# Altium schematic sheet Peripherals.SchDoc
size B; SheetNumber: 4; SheetTotal: 4
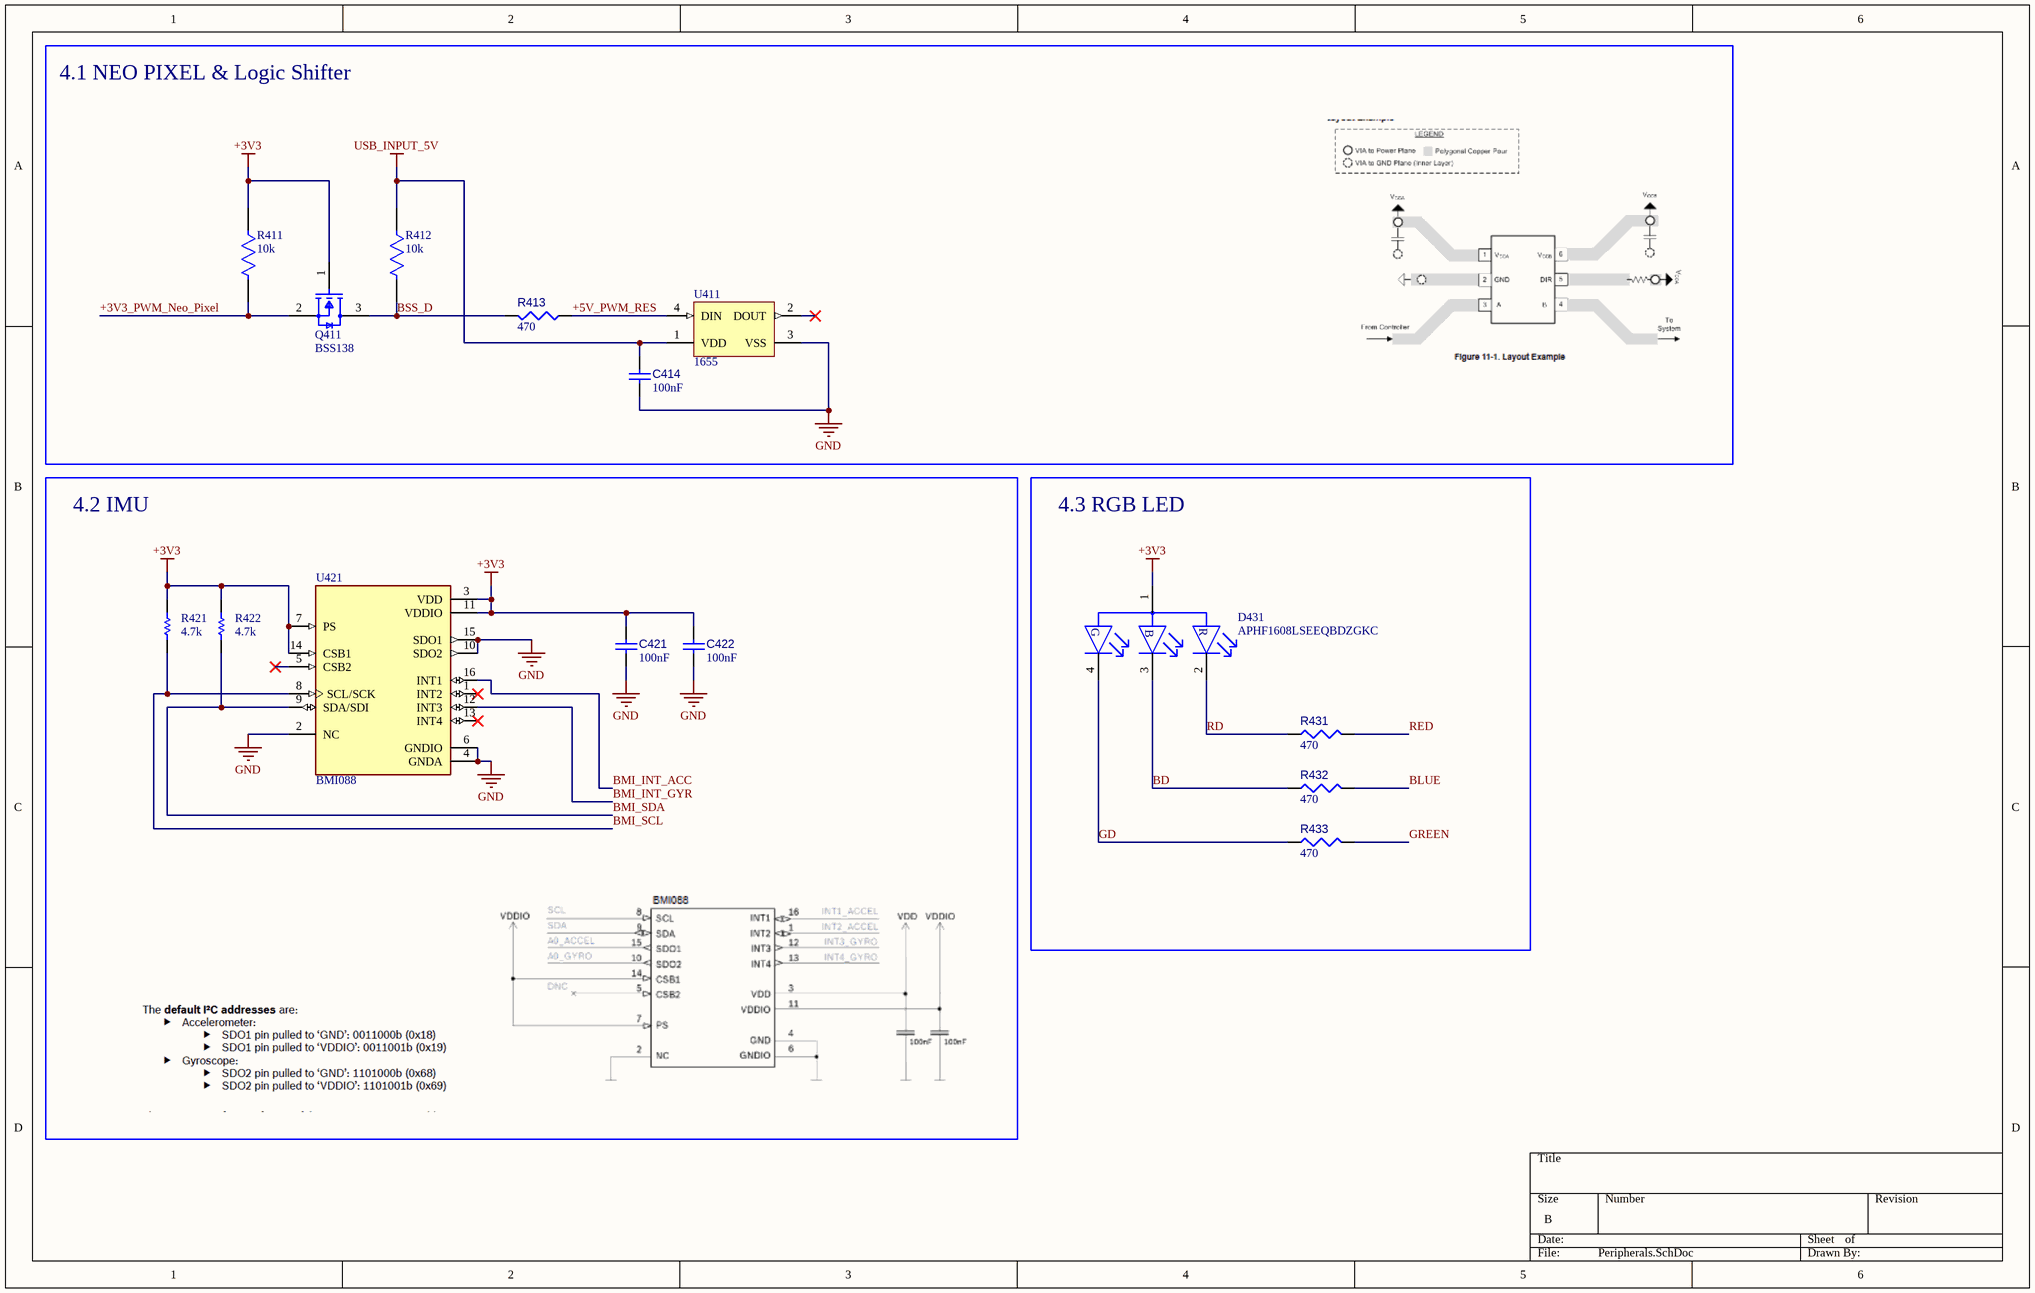
[diagram p0: Peripherals.SchDoc]

## Parts
C414  value 100nF  [CAPC0402(1005)60_L]  (hidden comment: Capacitor 100nF +/-20% 10V 0402)
C421  value 100nF  [CAPC0402(1005)60_L]  (hidden comment: Capacitor 100nF +/-20% 10V 0402)
C422  value 100nF  [CAPC0402(1005)60_L]  (hidden comment: Capacitor 100nF +/-20% 10V 0402)
D431  APHF1608LSEEQBDZGKC  [FP-APHF1608LSEEQBDZGKC-MFG]
Q411  BSS138  [FP-318-08-IPC_B]
R411  value 10k  [FP-RC0402-0_4-MFG]  (hidden comment: RC0402JR-0710KL)
R412  value 10k  [FP-RC0402-0_4-MFG]  (hidden comment: RC0402JR-0710KL)
R413  value 470  [RESC0805(2012)_L]  (hidden comment: Resistor 470R +/-5% 0805 125 mW)
R421  value 4.7k  [RESC1609X50X30NL10T20]  (hidden comment: CRCW06034K70FKTA)
R422  value 4.7k  [RESC1609X50X30NL10T20]  (hidden comment: CRCW06034K70FKTA)
R431  value 470  [RESC0805(2012)_L]  (hidden comment: Resistor 470R +/-5% 0805 125 mW)
R432  value 470  [RESC0805(2012)_L]  (hidden comment: Resistor 470R +/-5% 0805 125 mW)
R433  value 470  [RESC0805(2012)_L]  (hidden comment: Resistor 470R +/-5% 0805 125 mW)
U411  1655  [ADA-RGB-1655_V]
U421  BMI088  [PQFN50P450X300X100-16N]

## Blocks framed on the sheet
4.1 NEO PIXEL & Logic Shifter: C414 Q411 R411-R413 U411
4.2 IMU: C421 C422 R421 R422 U421
4.3 RGB LED: D431 R431-R433

## Nets
+3V3: C421.2 C422.2 D431.1(COMMON_ANODE) Q411.1(G) R411.1 R421.2 R422.2 U421.3(VDD) U421.7(PS) U421.11(VDDIO) U421.14(CSB1)
GND: C414.1 C421.1 C422.1 U411.3(VSS) U421.2(NC) U421.4(GNDA) U421.6(GNDIO) U421.10(SDO2) U421.15(SDO1)
USB_INPUT_5V: C414.2 R412.1 U411.1(VDD)
+3V3_PWM_Neo_Pixel: Q411.2(S) R411.2
+5V_PWM_RES: R413.1 U411.4(DIN)
BD: D431.3(Blue_C) R432.1
BLUE: R432.2
BMI_INT_ACC: U421.16(INT1)
BMI_INT_GYR: U421.12(INT3)
BMI_SCL: R421.1 U421.8(SCL/SCK)
BMI_SDA: R422.1 U421.9(SDA/SDI)
BSS_D: Q411.3(D) R412.2 R413.2
GD: D431.4(Green_C) R433.1
GREEN: R433.2
RD: D431.2(Red_C) R431.1
RED: R431.2

Not connected (* = marked no-connect by the designer): U411 2(DOUT)*; U421 1(INT2)* 5(CSB2)* 13(INT4)*

## Notes on the sheet
- (in symbol CMP-44529-000066-1) G; B; R

## Library data of the parts
C414 C421 C422 = CMP-001-00061-3: Chip Capacitor, 100nF +/-20%, 10V, 0402, Thickness 0.6 mm; Tolerance: 20%; Mounting Technology: SMT; Voltage Rating: 10V; Max Operating Temperature: 85°C; Pins: 2; Case/Package: 0402; Min Operating Temperature: -55°C
D431 = CMP-44529-000066-1: LED RGB CLEAR 4SMD; Test Current: 2mA; Lens Color: Colorless; Lens Size: 0.8mm; Viewing Angle: 140°; Element Configuration: Common Anode; Forward Voltage: 2.65V; Luminous Intensity: 10mcd; Color: Blue; Lens Style: Flat; Dominant Wavelength: 465nm; Packaging: Tape and Reel; Mount: Surface Mount; Length: 1.6mm; RoHS Compliant: Yes; Lens Transparency: Clear; Width: 0.8mm; Case/Package: SMD/SMT; Height: 0.6mm
Q411 = CMP-013-00036-1: Small Signal Field-Effect Transistor, 0.22A I(D), 50V, 1-Element, N-Channel, Silicon, Metal-oxide Semiconductor FET; RoHS Compliant: Yes
R411 R412 = CMP-009-00196-1: Fixed Resistor, Metal Glaze/thick Film, 0.0625W, 10000ohm, 50V, 5% +/-Tol, 100ppm/Cel, Surface Mount, 0402; Package Width: 0.5mm; Rated Temperature: 70°C; Power: 62.5mW; Package Height: 0.35mm; Temperature Coefficient: 100ppm/°C; Package Length: 1mm; Additional Feature: LASER TRIMMABLE; Reach SVHC Compliant: Yes; Terminal Finish: Nickel; Package Shape: Rectangular; Package Style: SMTMeter; JESD-609 Code: e3; Tolerance: 5%; Technology: METAL GLAZE/THICK FILM; Case/Package: 0402; Working Voltage: 50V; Termination: Wraparound; Min Operating Temperature: -55°C; Resistor Type: FIXED RESISTOR; Max Operating Temperature: 155°C; Construction: Chip; RoHS Compliant: Yes; Packaging: Tape and Reel; Mounting Technology: Surface Mount; Pins: 2
R413 R431-R433 = CMP-009-00122-3: Chip Resistor, 470 Ohms, +/-5%, 125 mW, -55 to 155 degC, 0805; Tolerance: 5%; Power: 125mW; Max Operating Temperature: 155°C; Case/Package: 0805; Pins: 2; Min Operating Temperature: -55°C
R421 R422 = CMP-009-00191-1: Fixed Resistor, Metal Glaze/thick Film, 0.1W, 4700ohm, 75V, 1% +/-Tol, 100ppm/Cel, Surface Mount, 0603; Rated Temperature: 70°C; Reference Standard: AEC-Q200; Package Width: 0.85mm; Power: 100mW; Package Length: 1.55mm; Temperature Coefficient: 100ppm/°C; Package Height: 0.45mm; Min Operating Temperature: -55°C; Max Operating Temperature: 155°C; Technology: METAL GLAZE/THICK FILM; Mounting Technology: Surface Mount; Package Style: SMTMeter; Termination: Wraparound; Case/Package: 0603; Pins: 2; JESD-609 Code: e0; Package Shape: Rectangular; Reach SVHC Compliant: No; Construction: Chip; Working Voltage: 75V; Terminal Finish: Nickel; Packaging: Tape and Reel; Tolerance: 1%; Resistor Type: FIXED RESISTOR; RoHS Compliant: No
U411 = CMP-007-00044-1: WS2812B 5050 RGB LED WITH INTEGRATED DRIVER CHIP PACK OF 10
U421 = CMP-003-000000-2: BMI088 Series 3.6 V 6 Axis Digital Output Accelerometer Motion Sensor - LGA-16; Component Type: Standard; Price: None; MP: BMI088; Design Item ID: BMI088; Source: BMI088.SchLib; Package: None; Pin Count: 16; Value: *; Availability: Unavailable